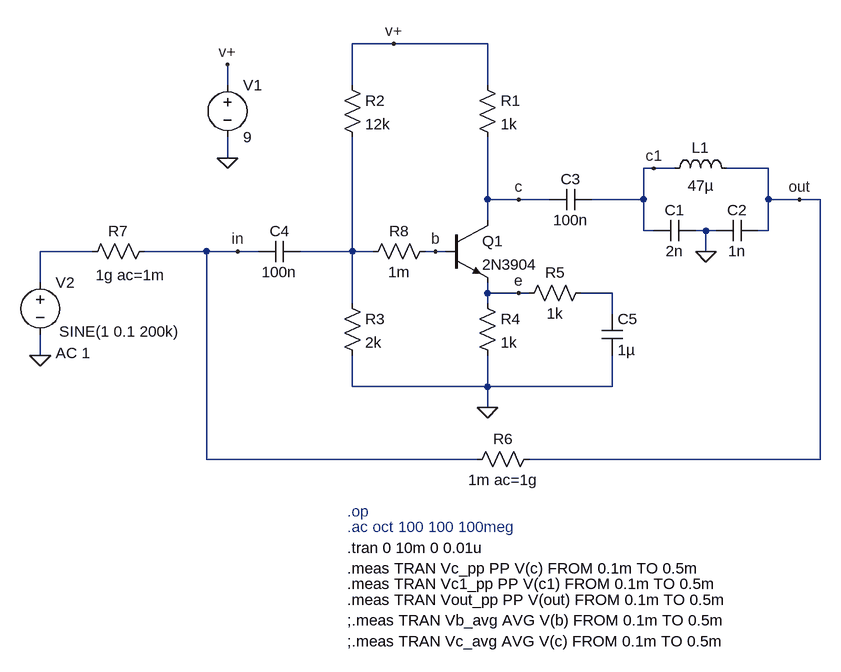
[diagram p0: schematic common_emitter_amplifier_with_lc_tank.asc]
common_emitter_amplifier_with_lc_tank.asc, the LTspice schematic file:
Version 4
SHEET 1 1412 680
WIRE 528 -304 464 -304
WIRE 672 -304 528 -304
WIRE 272 -240 272 -272
WIRE 464 -240 464 -304
WIRE 672 -240 672 -304
WIRE 272 -128 272 -160
WIRE 928 -112 912 -112
WIRE 960 -112 928 -112
WIRE 1104 -112 1040 -112
WIRE 672 -64 672 -160
WIRE 720 -64 672 -64
WIRE 768 -64 720 -64
WIRE 912 -64 912 -112
WIRE 912 -64 832 -64
WIRE 1104 -64 1104 -112
WIRE 1152 -64 1104 -64
WIRE 1184 -64 1152 -64
WIRE 672 -32 672 -64
WIRE 912 -16 912 -64
WIRE 928 -16 912 -16
WIRE 1008 -16 992 -16
WIRE 1024 -16 1008 -16
WIRE 1104 -16 1104 -64
WIRE 1104 -16 1088 -16
WIRE 64 16 -16 16
WIRE 240 16 144 16
WIRE 288 16 240 16
WIRE 320 16 288 16
WIRE 464 16 464 -160
WIRE 464 16 384 16
WIRE 496 16 464 16
WIRE 592 16 576 16
WIRE 608 16 592 16
WIRE 1008 16 1008 -16
WIRE -16 64 -16 16
WIRE 672 80 672 64
WIRE 720 80 672 80
WIRE 736 80 720 80
WIRE 864 80 816 80
WIRE 464 96 464 16
WIRE 672 96 672 80
WIRE 864 112 864 80
WIRE -16 176 -16 144
WIRE 464 224 464 176
WIRE 672 224 672 176
WIRE 672 224 464 224
WIRE 864 224 864 176
WIRE 864 224 672 224
WIRE 672 256 672 224
WIRE 240 336 240 16
WIRE 656 336 240 336
WIRE 1184 336 1184 -64
WIRE 1184 336 736 336
FLAG 672 256 0
FLAG 272 -128 0
FLAG 592 16 b
FLAG 720 -64 c
FLAG 720 80 e
FLAG 288 16 in
FLAG 1152 -64 out
FLAG -16 176 0
FLAG 1008 16 0
FLAG 528 -304 v+
FLAG 272 -272 v+
FLAG 928 -112 c1
SYMBOL npn 608 -32 R0
SYMATTR InstName Q1
SYMATTR Value 2N3904
SYMBOL res 656 -256 R0
SYMATTR InstName R1
SYMATTR Value 1k
SYMBOL voltage 272 -256 R0
WINDOW 123 0 0 Left 0
WINDOW 39 0 0 Left 0
SYMATTR InstName V1
SYMATTR Value 9
SYMBOL cap 768 -48 R270
WINDOW 0 32 32 VTop 2
WINDOW 3 0 32 VBottom 2
SYMATTR InstName C3
SYMATTR Value 100n
SYMBOL cap 384 0 R90
WINDOW 0 0 32 VBottom 2
WINDOW 3 32 32 VTop 2
SYMATTR InstName C4
SYMATTR Value 100n
SYMBOL res 448 -256 R0
SYMATTR InstName R2
SYMATTR Value 12k
SYMBOL res 448 80 R0
SYMATTR InstName R3
SYMATTR Value 2k
SYMBOL res 656 80 R0
SYMATTR InstName R4
SYMATTR Value 1k
SYMBOL cap 848 112 R0
SYMATTR InstName C5
SYMATTR Value 1µ
SYMBOL res 720 96 R270
WINDOW 0 32 56 VTop 2
WINDOW 3 0 56 VBottom 2
SYMATTR InstName R5
SYMATTR Value 1k
SYMBOL voltage -16 48 R0
WINDOW 3 29 91 Left 2
WINDOW 123 24 124 Left 2
WINDOW 39 0 0 Left 0
SYMATTR InstName V2
SYMATTR Value SINE(1 0.1 200k)
SYMATTR Value2 AC 1
SYMBOL ind 944 -96 R270
WINDOW 0 32 56 VTop 2
WINDOW 3 5 56 VBottom 2
SYMATTR InstName L1
SYMATTR Value 47µ
SYMBOL cap 992 -32 R90
WINDOW 0 0 32 VBottom 2
WINDOW 3 32 32 VTop 2
SYMATTR InstName C1
SYMATTR Value 2n
SYMBOL cap 1088 -32 R90
WINDOW 0 0 32 VBottom 2
WINDOW 3 32 32 VTop 2
SYMATTR InstName C2
SYMATTR Value 1n
SYMBOL res 752 320 R90
WINDOW 0 0 56 VBottom 2
WINDOW 3 32 56 VTop 2
SYMATTR InstName R6
SYMATTR Value 1m ac=1g
SYMBOL res 160 0 R90
WINDOW 0 0 56 VBottom 2
WINDOW 3 37 37 VTop 2
SYMATTR InstName R7
SYMATTR Value 1g ac=1m
SYMBOL res 480 32 R270
WINDOW 0 32 56 VTop 2
WINDOW 3 0 56 VBottom 2
SYMATTR InstName R8
SYMATTR Value 1m
TEXT 456 440 Left 2 ;.ac oct 100 100 100meg
TEXT 456 472 Left 2 !.tran 0 10m 0 0.01u
TEXT 456 504 Left 2 !.meas TRAN Vc_pp PP V(c) FROM 0.1m TO 0.5m
TEXT 456 552 Left 2 !.meas TRAN Vout_pp PP V(out) FROM 0.1m TO 0.5m
TEXT 456 584 Left 2 !;.meas TRAN Vb_avg AVG V(b) FROM 0.1m TO 0.5m
TEXT 456 616 Left 2 !;.meas TRAN Vc_avg AVG V(c) FROM 0.1m TO 0.5m
TEXT 456 416 Left 2 ;.op
TEXT 456 528 Left 2 !.meas TRAN Vc1_pp PP V(c1) FROM 0.1m TO 0.5m

The netlist it stands for:
* common_emitter_amplifier_with_lc_tank.asc
Q1 c b e 0 2N3904
R1 v+ c 1k
V1 v+ 0 9
C3 c c1 100n
C4 N002 in 100n
R2 v+ N002 12k
R3 N002 0 2k
R4 e 0 1k
C5 N003 0 1µ
R5 e N003 1k
V2 N001 0 SINE(1 0.1 200k) AC 1
L1 c1 out 47µ
C1 0 c1 2n
C2 out 0 1n
R6 out in 1m ac=1g
R7 in N001 1g ac=1m
R8 N002 b 1m
.model NPN NPN
.model PNP PNP
.lib standard.bjt
* .ac oct 100 100 100meg
.tran 0 10m 0 0.01u
.meas TRAN Vc_pp PP V(c) FROM 0.1m TO 0.5m
.meas TRAN Vout_pp PP V(out) FROM 0.1m TO 0.5m
;.meas TRAN Vb_avg AVG V(b) FROM 0.1m TO 0.5m
;.meas TRAN Vc_avg AVG V(c) FROM 0.1m TO 0.5m
* .op
.meas TRAN Vc1_pp PP V(c1) FROM 0.1m TO 0.5m
.backanno
.end